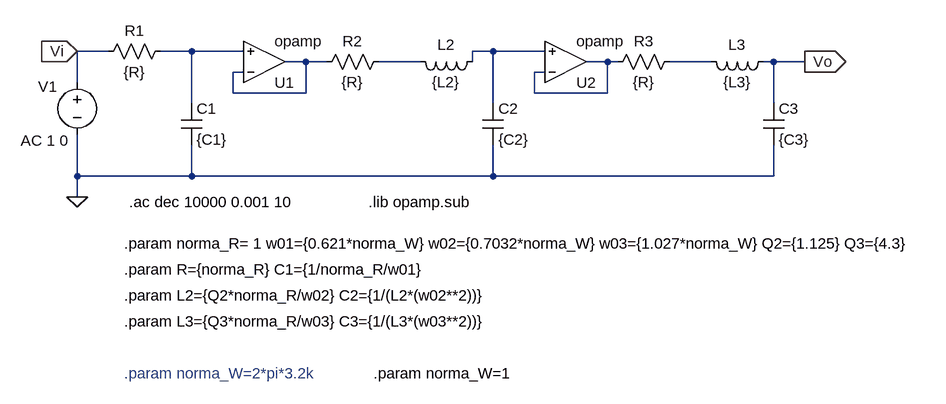
[diagram p0: schematic ej3_guiaTC2.asc]
ej3_guiaTC2.asc, the LTspice schematic file:
Version 4
SHEET 1 1376 680
WIRE 32 96 -16 96
WIRE 160 96 112 96
WIRE 240 96 160 96
WIRE 624 96 592 96
WIRE 704 96 624 96
WIRE 336 112 304 112
WIRE 368 112 336 112
WIRE 512 112 448 112
WIRE 592 112 592 96
WIRE 800 112 768 112
WIRE 816 112 800 112
WIRE 960 112 896 112
WIRE 1056 112 1040 112
WIRE 1104 112 1056 112
WIRE 240 128 224 128
WIRE 704 128 688 128
WIRE -16 144 -16 96
WIRE 224 160 224 128
WIRE 336 160 336 112
WIRE 336 160 224 160
WIRE 688 160 688 128
WIRE 800 160 800 112
WIRE 800 160 688 160
WIRE 160 176 160 96
WIRE 624 176 624 96
WIRE 1056 176 1056 112
WIRE -16 288 -16 224
WIRE 160 288 160 240
WIRE 160 288 -16 288
WIRE 624 288 624 240
WIRE 624 288 160 288
WIRE 1056 288 1056 240
WIRE 1056 288 624 288
WIRE -16 320 -16 288
FLAG 1104 112 Vo
IOPIN 1104 112 Out
FLAG -16 96 Vi
IOPIN -16 96 In
FLAG -16 320 0
SYMBOL res 128 80 R90
WINDOW 0 0 56 VBottom 2
WINDOW 3 32 56 VTop 2
SYMATTR InstName R1
SYMATTR Value {R}
SYMBOL res 464 96 R90
WINDOW 0 0 56 VBottom 2
WINDOW 3 32 56 VTop 2
SYMATTR InstName R2
SYMATTR Value {R}
SYMBOL res 912 96 R90
WINDOW 0 0 56 VBottom 2
WINDOW 3 32 56 VTop 2
SYMATTR InstName R3
SYMATTR Value {R}
SYMBOL cap 144 176 R0
SYMATTR InstName C1
SYMATTR Value {C1}
SYMBOL cap 608 176 R0
SYMATTR InstName C2
SYMATTR Value {C2}
SYMBOL cap 1040 176 R0
SYMATTR InstName C3
SYMATTR Value {C3}
SYMBOL ind 608 96 R90
WINDOW 0 5 56 VBottom 2
WINDOW 3 32 56 VTop 2
SYMATTR InstName L2
SYMATTR Value {L2}
SYMBOL ind 1056 96 R90
WINDOW 0 5 56 VBottom 2
WINDOW 3 32 56 VTop 2
SYMATTR InstName L3
SYMATTR Value {L3}
SYMBOL OpAmps\\opamp 272 176 M180
SYMATTR InstName U1
SYMBOL OpAmps\\opamp 736 176 M180
SYMATTR InstName U2
SYMBOL voltage -16 128 R0
WINDOW 0 -60 22 Left 2
WINDOW 123 -87 105 Left 2
WINDOW 39 0 0 Left 0
SYMATTR InstName V1
SYMATTR Value ""
SYMATTR Value2 AC 1 0
TEXT 432 328 Left 2 !.lib opamp.sub
TEXT 56 392 Left 2 !.param norma_R= 1 w01={0.621*norma_W} w02={0.7032*norma_W} w03={1.027*norma_W} Q2={1.125} Q3={4.3}
TEXT 56 432 Left 2 !.param R={norma_R} C1={1/norma_R/w01}
TEXT 56 472 Left 2 !.param L2={Q2*norma_R/w02} C2={1/(L2*(w02**2))}
TEXT 56 512 Left 2 !.param L3={Q3*norma_R/w03} C3={1/(L3*(w03**2))}
TEXT 64 328 Left 2 !.ac dec 10000 0.001 10
TEXT 56 592 Left 2 ;.param norma_W=2*pi*3.2k
TEXT 440 592 Left 2 !.param norma_W=1

The netlist it stands for:
* ej3_guiaTC2.asc
R1 N001 Vi {R}
R2 N004 N003 {R}
R3 N006 N005 {R}
C1 N001 0 {C1}
C2 N002 0 {C2}
C3 Vo 0 {C3}
L2 N002 N004 {L2}
L3 Vo N006 {L3}
XU1 N003 N001 N003 opamp Aol=100K GBW=10Meg  ; pins invin noninvin out
XU2 N005 N002 N005 opamp Aol=100K GBW=10Meg  ; pins invin noninvin out
V1 Vi 0 AC 1 0
.lib opamp.sub
.param norma_R= 1 w01={0.621*norma_W} w02={0.7032*norma_W} w03={1.027*norma_W} Q2={1.125} Q3={4.3}
.param R={norma_R} C1={1/norma_R/w01}
.param L2={Q2*norma_R/w02} C2={1/(L2*(w02**2))}
.param L3={Q3*norma_R/w03} C3={1/(L3*(w03**2))}
.ac dec 10000 0.001 10
* .param norma_W=2*pi*3.2k
.param norma_W=1
.backanno
.end